# Altium project PCB_Project_3.PrjPcb
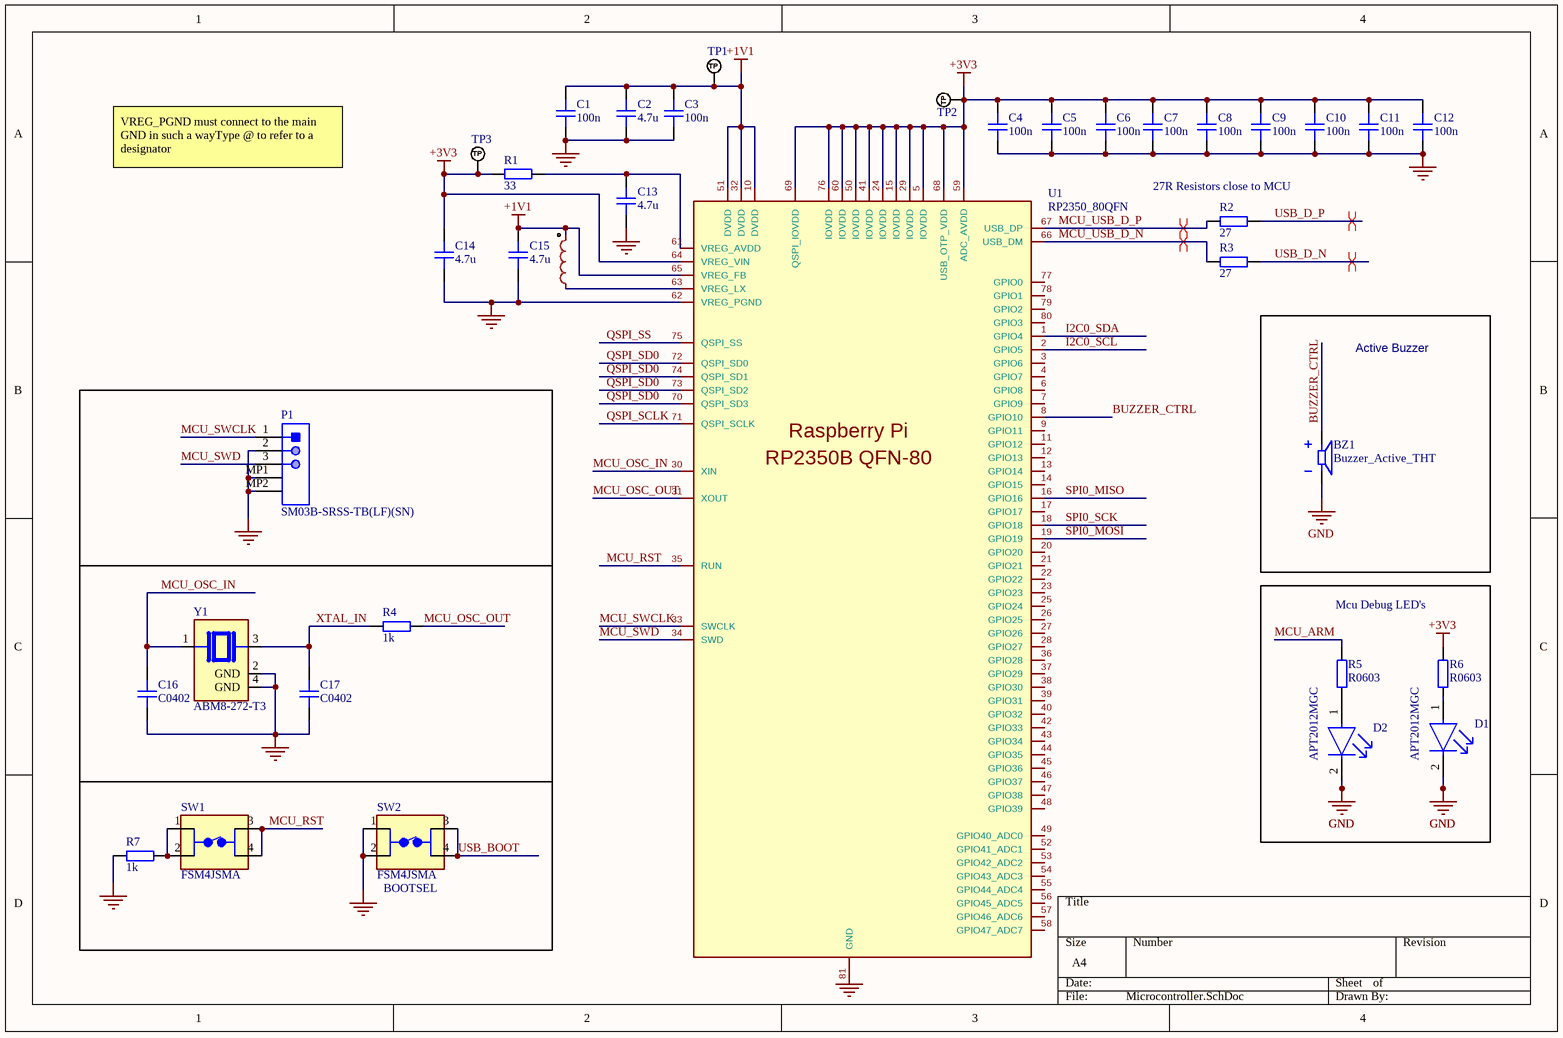
[diagram p0: Microcontroller.SchDoc]
5 sheets, 101 parts. Net scope: global (net labels, ports and power ports of the same name join across sheets).
Board file: PCB1.PcbDoc
Sheets:
  Microcontroller.SchDoc
  Firing channels.SchDoc
  MCU_SLAVES.SchDoc
  Sheet2.SchDoc
  storage.SchDoc

## Sheet Microcontroller.SchDoc
size A4; SheetNumber: 1; SheetTotal: 6

### Parts
BZ1  Buzzer_Active_THT  [Buzzer_Active_Tht]
C1  100n  [CAP_0402]
C2  4.7u  [CAP_0402]
C3  100n  [CAP_0402]
C4  100n  [CAP_0402]
C5  100n  [CAP_0402]
C6  100n  [CAP_0402]
C7  100n  [CAP_0402]
C8  100n  [CAP_0402]
C9  100n  [CAP_0402]
C10  100n  [CAP_0402]
C11  100n  [CAP_0402]
C12  100n  [CAP_0402]
C13  4.7u  [CAP_0402]
C14  4.7u  [CAP_0402]
C15  4.7u  [CAP_0402]
C16  C0402  [CAP_0402]
C17  C0402  [CAP_0402]
D1  APT2012MGC  [FP-APT2012MGC-MFG]
D2  APT2012MGC  [FP-APT2012MGC-MFG]
L1  3.3uH  [IND-SMD_L2.0-W1.6_AOTA-B201610S3R3-101-T]  (value not drawn)
P1  SM03B-SRSS-TB(LF)(SN)  [JST-SM03B-SRSS-TB_V]
R1  33  [RES_0402]
R2  27  [RES_0402]
R3  27  [RES_0402]
R4  1k  [RES_0402]
R5  R0603  [RES_0603]
R6  R0603  [RES_0603]
R7  1k  [RES_0402]
SW1  FSM4JSMA  [TE_FSM4JSMA]
SW2  FSM4JSMA  [TE_FSM4JSMA]
TP1  TEST_POINT_RND_1MM  [PAD_RND_1MM]  (value not drawn)  (no BOM)
TP2  TEST_POINT_RND_1MM  [PAD_RND_1MM]  (value not drawn)  (no BOM)
TP3  TEST_POINT_RND_1MM  [PAD_RND_1MM]  (value not drawn)  (no BOM)
U1  RP2350_80QFN  [RP2350-QFN-80-1EP_10x10_P0.4mm_EP3.4x3.4mm_ThermalVias]
Y1  ABM8-272-T3  [XTAL_ABM8-272-T3]

### Blocks framed on the sheet
Active Buzzer: BZ1
BOOTSEL: C16 C17 P1 R4 R7 SW1 SW2 Y1
Mcu Debug LED's: D1 D2 R5 R6

### Nets
+1V1: C1.1 C2.1 C3.1 C15.1 L1.2 TP1.1(TP) U1.10(DVDD) U1.32(DVDD) U1.51(DVDD) U1.65(VREG_FB)
+3V3: C4.1 C5.1 C6.1 C7.1 C8.1 C9.1 C10.1 C11.1 C12.1 C14.1 R1.2 R6.2 TP2.1(TP) TP3.1(TP) U1.5(IOVDD) U1.15(IOVDD) U1.24(IOVDD) U1.29(IOVDD) U1.41(IOVDD) U1.50(IOVDD) U1.59(ADC_AVDD) U1.60(IOVDD) U1.64(VREG_VIN) U1.68(USB_OTP_VDD) U1.69(QSPI_IOVDD) U1.76(IOVDD)
GND: BZ1.N C1.2 C2.2 C3.2 C4.2 C5.2 C6.2 C7.2 C8.2 C9.2 C10.2 C11.2 C12.2 C13.2 C14.2 C15.2 C16.2 C17.2 D1.2(C) D2.2(C) P1.2 P1.MP1 P1.MP2 R7.2 SW2.1 SW2.2 U1.62(VREG_PGND) U1.81(GND) Y1.2(GND) Y1.4(GND)
BUZZER_CTRL: BZ1.P U1.8(GPIO10)
I2C0_SCL: U1.2(GPIO5)
I2C0_SDA: U1.1(GPIO4)
MCU_ARM: R5.2
MCU_OSC_IN: C16.1 U1.30(XIN) Y1.1
MCU_OSC_OUT: R4.1 U1.31(XOUT)
MCU_RST: SW1.3 SW1.4 U1.35(RUN)
MCU_SWCLK: P1.1 U1.33(SWCLK)
MCU_SWD: P1.3 U1.34(SWD)
MCU_USB_D_N: R3.2 U1.66(USB_DM)
MCU_USB_D_P: R2.2 U1.67(USB_DP)
QSPI_SCLK: U1.71(QSPI_SCLK)
QSPI_SD0: U1.70(QSPI_SD3) U1.72(QSPI_SD0) U1.73(QSPI_SD2) U1.74(QSPI_SD1)
QSPI_SS: U1.75(QSPI_SS)
SPI0_MISO: U1.16(GPIO16)
SPI0_MOSI: U1.19(GPIO19)
SPI0_SCK: U1.18(GPIO18)
USB_BOOT: SW2.3 SW2.4
USB_D_N: R3.1
USB_D_P: R2.1
XTAL_IN: C17.1 R4.2 Y1.3
NetC13_1: C13.1 R1.1 U1.61(VREG_AVDD)
NetD1_1: D1.1(A) R6.1
NetD2_1: D2.1(A) R5.1
NetL1_1: L1.1 U1.63(VREG_LX)
NetR7_1: R7.1 SW1.1 SW1.2

Not connected (* = marked no-connect by the designer): U1 3(GPIO6) 4(GPIO7) 6(GPIO8) 7(GPIO9) 9(GPIO11) 11(GPIO12) 12(GPIO13) 13(GPIO14) 14(GPIO15) 17(GPIO17) 20(GPIO20) 21(GPIO21) 22(GPIO22) 23(GPIO23) 25(GPIO24) 26(GPIO25) 27(GPIO26) 28(GPIO27) 36(GPIO28) 37(GPIO29) 38(GPIO30) 39(GPIO31) 40(GPIO32) 42(GPIO33) 43(GPIO34) 44(GPIO35) 45(GPIO36) 46(GPIO37) 47(GPIO38) 48(GPIO39) 49(GPIO40_ADC0) 52(GPIO41_ADC1) 53(GPIO42_ADC2) 54(GPIO43_ADC3) 55(GPIO44_ADC4) 56(GPIO45_ADC5) 57(GPIO46_ADC6) 58(GPIO47_ADC7) 77(GPIO0) 78(GPIO1) 79(GPIO2) 80(GPIO3)

### Layout directives
differential pair: MCU_USB_D_N, MCU_USB_D_P, USB_D_N, USB_D_P

### Notes on the sheet
- VREG_PGND must connect to the main GND in such a wayType @ to refer to a designator
- 27R Resistors close to MCU
- (in symbol RP2350_80QFN) Raspberry Pi; RP2350B QFN-80

### Library data of the parts
C1-C17 = CAP_0402: Capacitor SMD 0402; Manufacturer: *; Manufacturer Part Number: *; Distributor Link: *; LCSC: *; Rating: *; Dielectric: *
D1 D2 = CMP-44529-000017-1: LED GREEN CLEAR CHIP SMD; Power Rating: 75mW; Lens Color: Colorless; Luminous Intensity: 70mcd; Forward Current: 20mA; Dominant Wavelength: 570nm; Viewing Angle: 120°; Forward Voltage: 2.1V; Package Quantity: 2000; Color: Green; Length: 2mm; Lead Free: Lead Free; Min Operating Temperature: -40°C; Illumination Color: Green; Case/Package: 0805; Width: 1.25mm; Test Current: 20mA; Max Operating Temperature: 85°C; Case Code (Imperial): 0805; Mount: Surface Mount; Lens Style: Clear; Height: 0.75mm; Case Code (Metric): 2012; Packaging: Tape and Reel; Lens Transparency: Clear
L1 = AOTA-B201610S3R3-101-T: Manufacturer: ABRACON; Add into BOM: yes; Current Rating: 2.1A; Current - Saturation(Isat): 2.4A; DC Resistance(DCR): 115mΩ; Type: Molded Inductor; Symbol: AOTA-B201610S3R3-101-T; Device: AOTA-B201610S3R3-101-T; LCSC Part Name: 3.3uH 2.4A; Supplier Part: C42411119; Manufacturer Part: AOTA-B201610S3R3-101-T; Supplier Footprint: 0806; JLCPCB Part Class: Extended Part; Datasheet: https://item.szlcsc.com/datasheet/AOTA-B201610S3R3-101-T/44392932.html; Supplier: LCSC; Convert to PCB: yes; Value: 3.3uH
P1 = CMP-2000-07077-1: Male Header, Pitch 1 mm, 1 x 3 Position, Height 2.9 mm, -25 to 85 degC, RoHS, Tape and Reel; Manufacturer: JST; Pitch: 1mm; Style/Orientation: RightAngleHeader/Plug; No of Positions: 3; Package Description: Male Header, Pitch 1 mm, 1 x 3 Position, Height 2.9 mm; Manufacturer URL: http://www.jst.com/home2.html; Package Reference: SM03B-SRSS-TB; Type: ShroudedHeader; Termination: Crimp; Mounting Technology: SurfaceMount; Datasheet Version: 11/2010; Datasheet URL: https://datasheet.ciiva.com/26894/getdatasheetpartid-708885-26894671.pdf
R1-R4 R7 = RES_0402: Resistor SMD 0402; Manufacturer: *; Manufacturer Part Number: *; Distributor Link: *; LCSC: *
R5 R6 = RES_0603: Resistor SMD 0603; Manufacturer: *; Manufacturer Part Number: *; Distributor Link: *; LCSC: *
SW1 SW2 = FSM4JSMA: Tactile Switch SPST-NO Top Actuated Surface Mount; MF: TE Connectivity; MP: FSM-4J-SMA; SnapEDA_Link: https://www.snapeda.com/parts/FSM-4J-SMA/TE+Connectivity+ALCOSWITCH+Switches/view-part/?ref=snap; Package: None; Value: *; Check_prices: https://www.snapeda.com/parts/FSM-4J-SMA/TE+Connectivity+ALCOSWITCH+Switches/view-part/?ref=eda
TP1-TP3 = CMP-019-000001-1: Test Point Round 1mm (NO BOM); Design Item ID: TEST_POINT_RND_1MM; Source: Schematic-Lib-PhilsLab.SchLib
Y1 = ABM8-272-T3: 12 MHz Â±30ppm Crystal 10pF 50 Ohms 4-SMD, No Lead; MF: ABRACON; SnapEDA_Link: https://www.snapeda.com/parts/ABM8-272-T3/Abracon/view-part/?ref=snap; Package: NON-STANDARD-4 Abracon; Value: *; MP: ABM8-272-T3; Check_prices: https://www.snapeda.com/parts/ABM8-272-T3/Abracon/view-part/?ref=eda

## Sheet Firing channels.SchDoc
size 381 x 241 mm; SheetNumber: 2; SheetTotal: 6
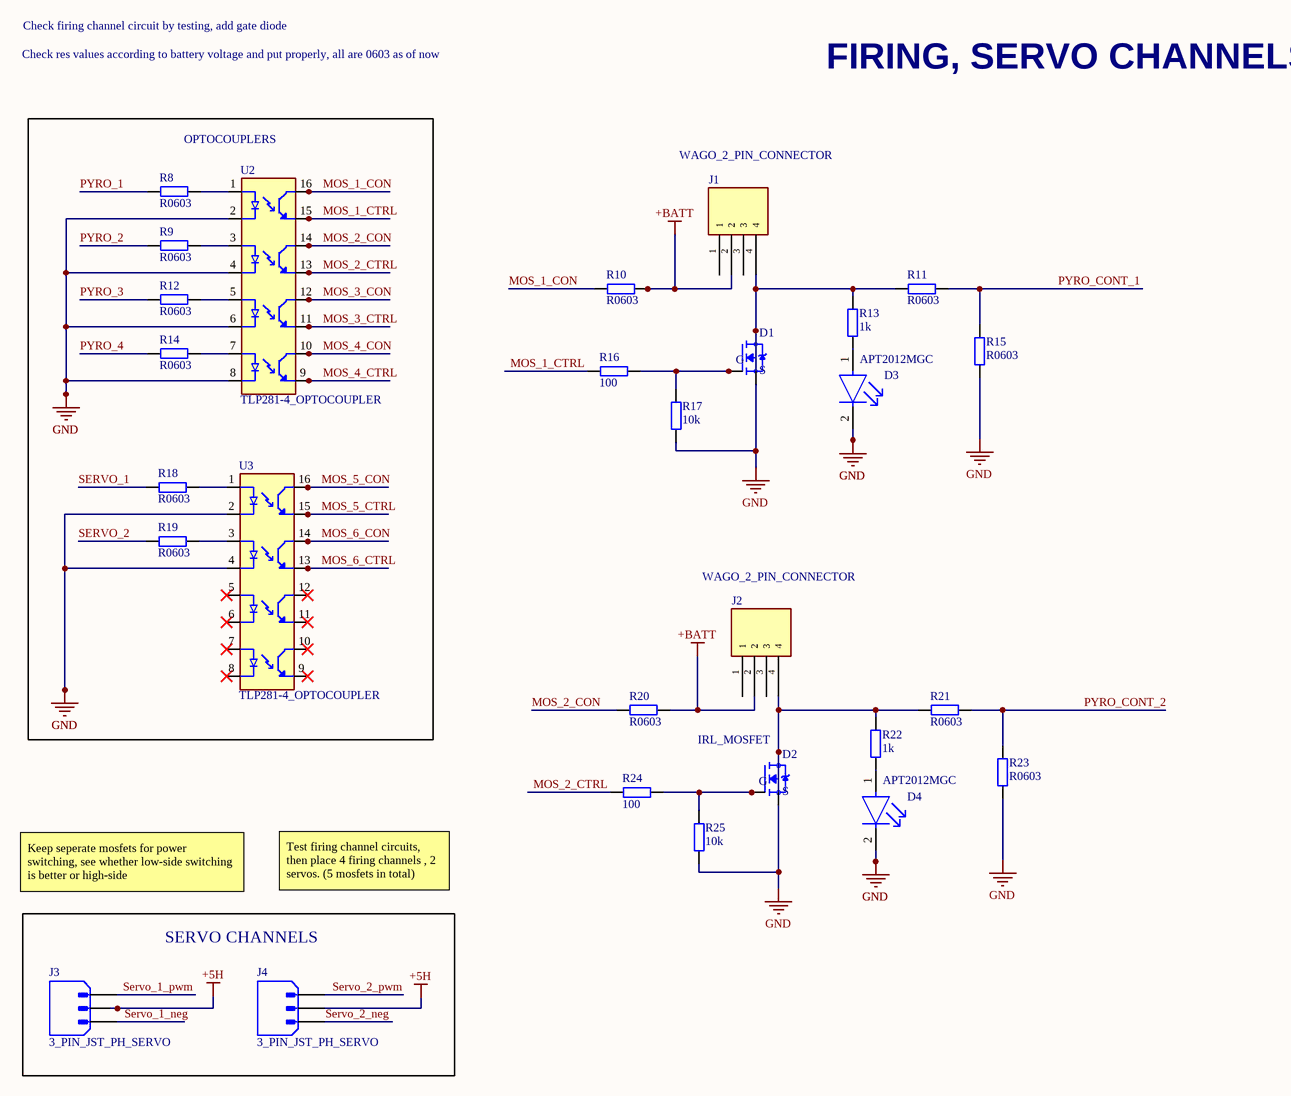
[diagram p1: Firing channels.SchDoc]

### Parts
1  (no value)  [IRLR7843]
2  IRL_MOSFET  [IRLR7843]
D3  APT2012MGC  [FP-APT2012MGC-MFG]
D4  APT2012MGC  [FP-APT2012MGC-MFG]
J1  WAGO_2_PIN_CONNECTOR  [WAGO_CONNECTOR]
J2  WAGO_2_PIN_CONNECTOR  [WAGO_CONNECTOR]
J3  3_PIN_JST_PH_SERVO  [3_PIN_JST_PH_SERVO]
J4  3_PIN_JST_PH_SERVO  [3_PIN_JST_PH_SERVO]
R8  R0603  [RES_0603]
R9  R0603  [RES_0603]
R10  R0603  [RES_0603]
R11  R0603  [RES_0603]
R12  R0603  [RES_0603]
R13  1k  [RES_0603]
R14  R0603  [RES_0603]
R15  R0603  [RES_0603]
R16  100  [RES_0603]
R17  10k  [RES_0603]
R18  R0603  [RES_0603]
R19  R0603  [RES_0603]
R20  R0603  [RES_0603]
R21  R0603  [RES_0603]
R22  1k  [RES_0603]
R23  R0603  [RES_0603]
R24  100  [RES_0603]
R25  10k  [RES_0603]
U2  TLP281-4_OPTOCOUPLER  [TLP281-4_OPTOCOUPLER]
U3  TLP281-4_OPTOCOUPLER  [TLP281-4_OPTOCOUPLER]

### Blocks framed on the sheet
OPTOCOUPLERS: R8 R9 R12 R14 R18 R19 U2 U3
SERVO CHANNELS: J3 J4

### Nets
+5H: J3.2 J4.2
+BATT: J1.2 J2.2 R10.2 R20.2
GND: 1.2(S) 2.2(S) D3.2(C) D4.2(C) R15.1 R17.1 R23.1 R25.1 U2.2(C1) U2.4(C2) U2.6(C3) U2.8(C4) U3.2(C1) U3.4(C2)
MOS_1_CON: R10.1 U2.16(CT1)
MOS_1_CTRL: R16.1 U2.15(ET1)
MOS_2_CON: R20.1 U2.14(CT2)
MOS_2_CTRL: R24.1 U2.13(ET2)
MOS_3_CON: U2.12(CT3)
MOS_3_CTRL: U2.11(ET3)
MOS_4_CON: U2.10(CT4)
MOS_4_CTRL: U2.9(ET4)
MOS_5_CON: U3.16(CT1)
MOS_5_CTRL: U3.15(ET1)
MOS_6_CON: U3.14(CT2)
MOS_6_CTRL: U3.13(ET2)
PYRO_1: R8.1
PYRO_2: R9.1
PYRO_3: R12.1
PYRO_4: R14.1
PYRO_CONT_1: R11.2 R15.2
PYRO_CONT_2: R21.2 R23.2
SERVO_1: R18.1
Servo_1_neg: J3.1
Servo_1_pwm: J3.3
SERVO_2: R19.1
Servo_2_neg: J4.1
Servo_2_pwm: J4.3
Net1_1: 1.1(G) R16.2 R17.2
Net1_3: 1.3(D) J1.4 R11.1 R13.2
Net2_1: 2.1(G) R24.2 R25.2
Net2_3: 2.3(D) J2.4 R21.1 R22.2
NetD3_1: D3.1(A) R13.1
NetD4_1: D4.1(A) R22.1
NetR8_2: R8.2 U2.1(A1)
NetR9_2: R9.2 U2.3(A2)
NetR12_2: R12.2 U2.5(A3)
NetR14_2: R14.2 U2.7(A4)
NetR18_2: R18.2 U3.1(A1)
NetR19_2: R19.2 U3.3(A2)

Not connected (* = marked no-connect by the designer): J1 1 3; J2 1 3; U3 5(A3)* 6(C3)* 7(A4)* 8(C4)* 9(ET4)* 10(CT4)* 11(ET3)* 12(CT3)*

### Notes on the sheet
- Check firing channel circuit by testing, add gate diode
- Check res values according to battery voltage and put properly, all are 0603 as of now
- FIRING, SERVO CHANNELS
- Keep seperate mosfets for power switching, see whether low-side switching is better or high-side
- Test firing channel circuits, then place 4 firing channels , 2 servos. (5 mosfets in total)

### Library data of the parts
1 = IRL_MOSFET
D3 D4 = CMP-44529-000017-1: as D1 on sheet Microcontroller; Package Quantity: 2000; Color: Green; Length: 2mm; Lead Free: Lead Free; Min Operating Temperature: -40°C; Illumination Color: Green; Case/Package: 0805; Width: 1.25mm; Test Current: 20mA; Max Operating Temperature: 85°C; Case Code (Imperial): 0805; Mount: Surface Mount; Lens Style: Clear; Height: 0.75mm; Case Code (Metric): 2012; Packaging: Tape and Reel; Lens Transparency: Clear
R8-R25 = RES_0603: Resistor SMD 0603; Manufacturer: *; Manufacturer Part Number: *; Distributor Link: *; LCSC: *

## Sheet MCU_SLAVES.SchDoc
size A4; SheetNumber: 3; SheetTotal: 6
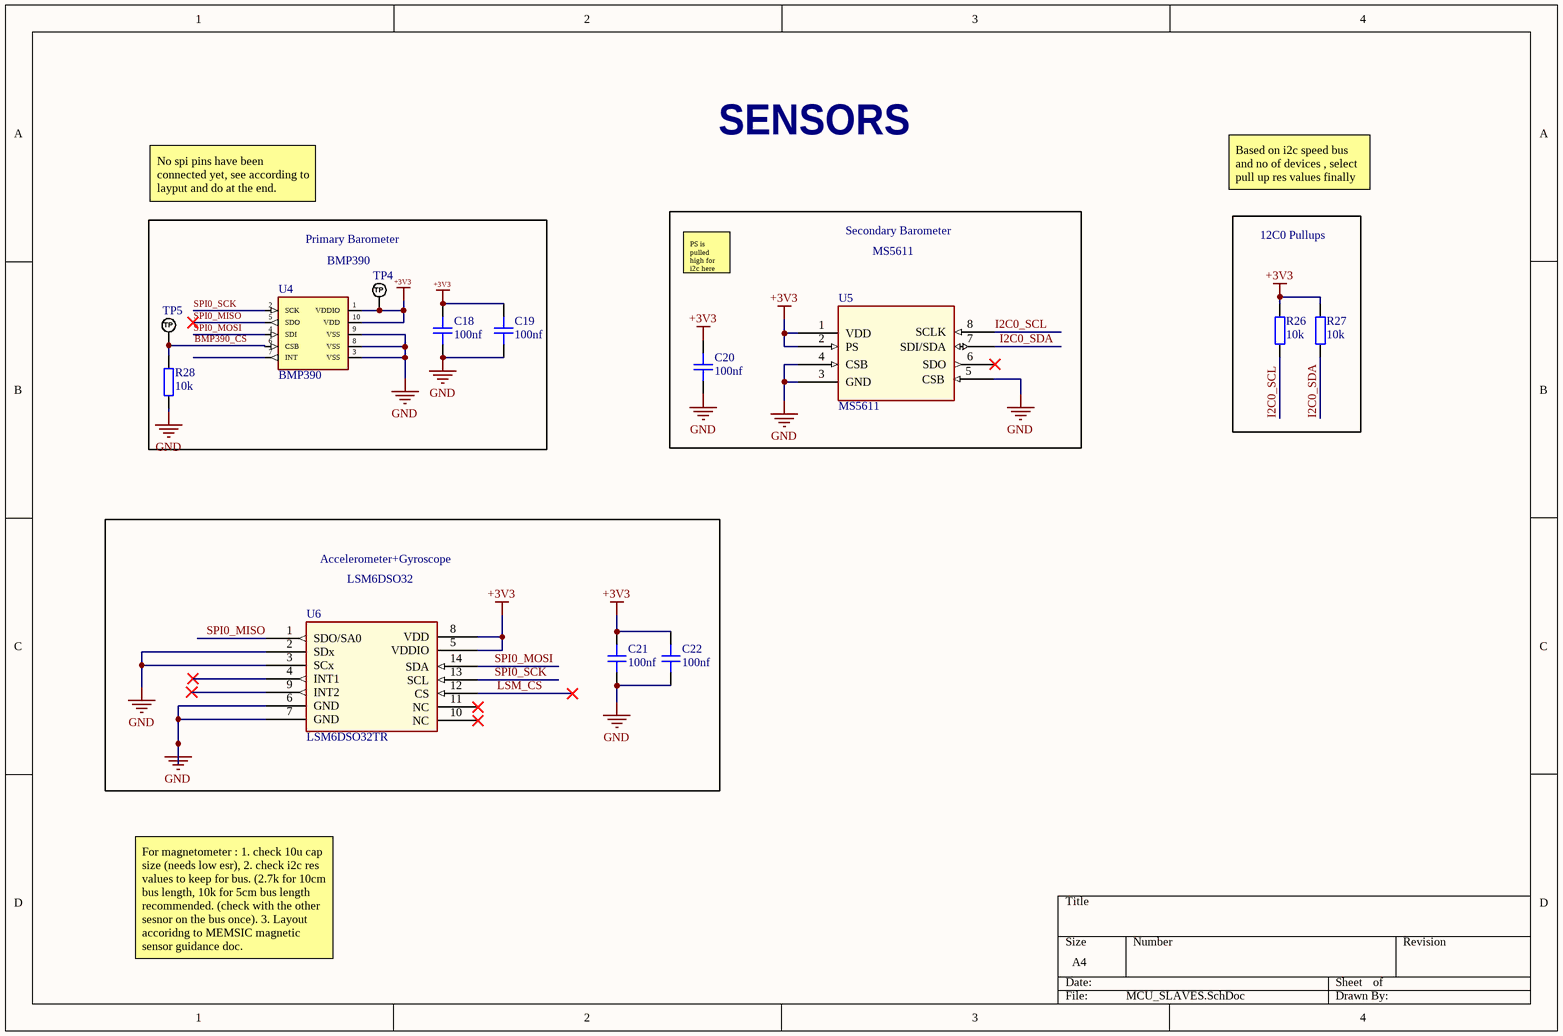
[diagram p2: MCU_SLAVES.SchDoc]

### Parts
C18  100nf  [CAP_0402]
C19  100nf  [CAP_0402]
C20  100nf  [CAP_0402]
C21  100nf  [CAP_0402]
C22  100nf  [CAP_0402]
R26  10k  [RES_0402]
R27  10k  [RES_0402]
R28  10k  [RES_0402]
TP4  TEST_POINT_RND_1MM  [PAD_RND_1MM]  (value not drawn)  (no BOM)
TP5  TEST_POINT_RND_1MM  [PAD_RND_1MM]  (value not drawn)  (no BOM)
U4  BMP390  [BMP390]
U5  MS5611  [MS5611]
U6  LSM6DSO32TR  [LSM6DSO32TR]

### Blocks framed on the sheet
12C0 Pullups: R26 R27

### Nets
+3V3: C18.2 C19.2 C20.2 C21.2 C22.1 R26.2 R27.2 TP4.1(TP) U4.1(VDDIO) U4.10(VDD) U5.1(VDD) U5.2(PS) U6.5(VDDIO) U6.8(VDD)
GND: C18.1 C19.1 C20.1 C21.1 C22.2 R28.1 U4.3(VSS) U4.8(VSS) U4.9(VSS) U5.3(GND) U5.4(CSB) U5.5(CSB) U6.2(SDx) U6.3(SCx) U6.6(GND) U6.7(GND)
BMP390_CS: R28.2 TP5.1(TP) U4.6(CSB)
I2C0_SCL: R26.1 U5.8(SCLK)
I2C0_SDA: R27.1 U5.7(SDI/SDA)
LSM_CS: U6.12(CS)
SPI0_MISO: U4.5(SDO) U6.1(SDO/SA0)
SPI0_MOSI: U4.4(SDI) U6.14(SDA)
SPI0_SCK: U4.2(SCK) U6.13(SCL)

Not connected (* = marked no-connect by the designer): U4 7(INT); U5 6(SDO)*; U6 4(INT1)* 9(INT2)* 10(NC)* 11(NC)*

### Notes on the sheet
- SENSORS
- No spi pins have been connected yet, see according to layput and do at the end.
- Primary Barometer
- Secondary Barometer
- Based on i2c speed bus and no of devices , select pull up res values finally
- BMP390
- PS is pulled high for i2c here
- MS5611
- Accelerometer+Gyroscope
- (near U6) LSM6DSO32
- For magnetometer : 1. check 10u cap size (needs low esr), 2. check i2c res values to keep for bus. (2.7k for 10cm bus length, 10k for 5cm bus length recommended. (check with the other sesnor on the bus once). 3. Layout accoridng to MEMSIC magnetic sensor guidance doc.

### Library data of the parts
C18-C22 = CAP_0402: Capacitor SMD 0402; Manufacturer: *; Manufacturer Part Number: *; Distributor Link: *; LCSC: *; Rating: *; Dielectric: *
R26-R28 = RES_0402: Resistor SMD 0402; Manufacturer: *; Manufacturer Part Number: *; Distributor Link: *; LCSC: *
TP4 TP5 = CMP-019-000001-1: Test Point Round 1mm (NO BOM); Design Item ID: TEST_POINT_RND_1MM; Source: Schematic-Lib-PhilsLab.SchLib

## Sheet Sheet2.SchDoc
size A4; SheetNumber: 4; SheetTotal: 5
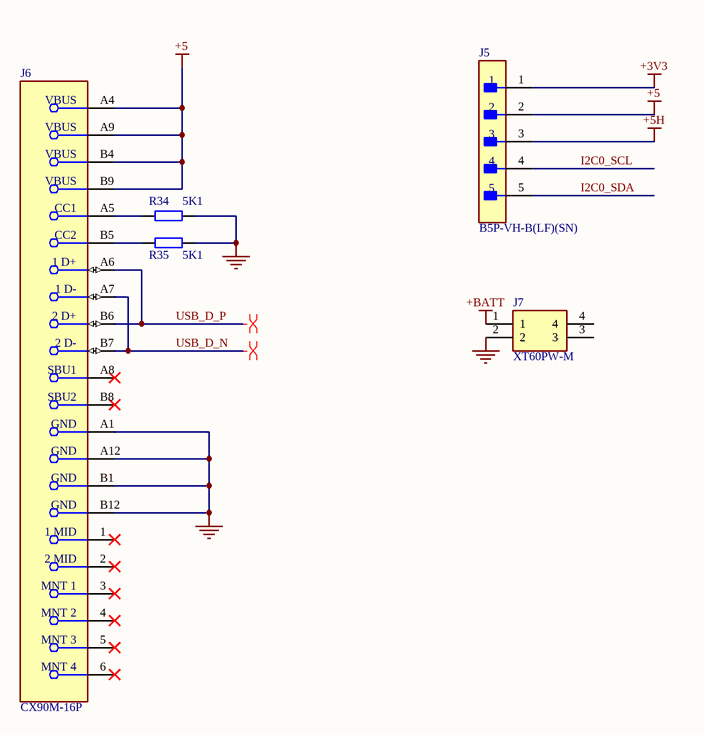
[diagram p3: Sheet2.SchDoc]

### Parts
J5  B5P-VH-B(LF)(SN)  [FP-B5P-VH-B_LF_SN-MFG]
J6  CX90M-16P  [FP-CX90M-16P-MFG]
J7  XT60PW-M  [XT60PWM]
R34  5K1  [RES_0402]
R35  5K1  [RES_0402]

### Nets
+3V3: J5.1
+5: J5.2 J6.A4(VBUS) J6.A9(VBUS) J6.B4(VBUS) J6.B9(VBUS)
+5H: J5.3
+BATT: J7.1
GND: J6.A1(GND) J6.A12(GND) J6.B1(GND) J6.B12(GND) J7.2 R34.2 R35.2
I2C0_SCL: J5.4
I2C0_SDA: J5.5
USB_D_N: J6.A7(1_D-) J6.B7(2_D-)
USB_D_P: J6.A6(1_D+) J6.B6(2_D+)
NetJ6_A5: J6.A5(CC1) R34.1
NetJ6_B5: J6.B5(CC2) R35.1

Not connected (* = marked no-connect by the designer): J6 1(1_MID)* 2(2_MID)* 3(MNT_1)* 4(MNT_2)* 5(MNT_3)* 6(MNT_4)* A8(SBU1)* B8(SBU2)*; J7 3 4

### Layout directives
differential pair: USB_D_N, USB_D_P

### Library data of the parts
J5 = CMP-17439-000483-1: CONN HEADER VERT 5POS 3.96MM; Contact Resistance: 20mR; Number of Positions: 5; Max Current Rating: 10A; Voltage Rating: 250V; Min Operating Temperature: -25°C; Fastening Type: Ramp; Max Operating Temperature: 85°C; Series: VH; Contact Finish - Mating: TIN; Depth: 8.5mm; Insulation Color: Natural; Length: 19.74mm; Number of Rows: 1; Flammability Rating: UL94 V-0; Orientation: Straight; Packaging: Bulk; Lead Free: Lead Free; Pitch: 3.96mm; Contact Material: Brass; Connector Type: Header; Housing Color: White; Contact Plating: Copper; Number of Pins: 5; Contact Shape: Square; Insulation Material: PBT; Max Voltage Rating (AC): 250V; Contact Type: Male Pin; Color: White; Termination: Solder
J6 = CMP-11601-000005-1: CONN RCPT USB2.0 TYPEC 16POS SMD; Connector Type: USB; Current Rating: 1.25A; Mating Cycles: 10000; Number of Contacts: 16; Gender: Receptacle; Shielding: Shielded; Number of Ports: 1; Insulation Color: Black; Termination: Solder; Min Operating Temperature: -30°C; Flammability Rating: UL94 V-0; Max Operating Temperature: 85°C; Packaging: Cut Tape; Contact Plating: Gold; Mount: Surface Mount
J7 = XT60PW-M: Connector; Manufacturer_Name: Changzou Amass Elec; Datasheet Link: https://www.tme.eu/Document/9b8d0c5eb7094295f3d3112c214d3ade/XT60PW%20SPEC.pdf; Height: 8.4mm; Manufacturer_Part_Number: XT60PW-M
R34 R35 = RES_0402: Resistor SMD 0402; Manufacturer: *; Manufacturer Part Number: *; Distributor Link: *; LCSC: *

## Sheet storage.SchDoc
size A4; SheetNumber: 5; SheetTotal: 5
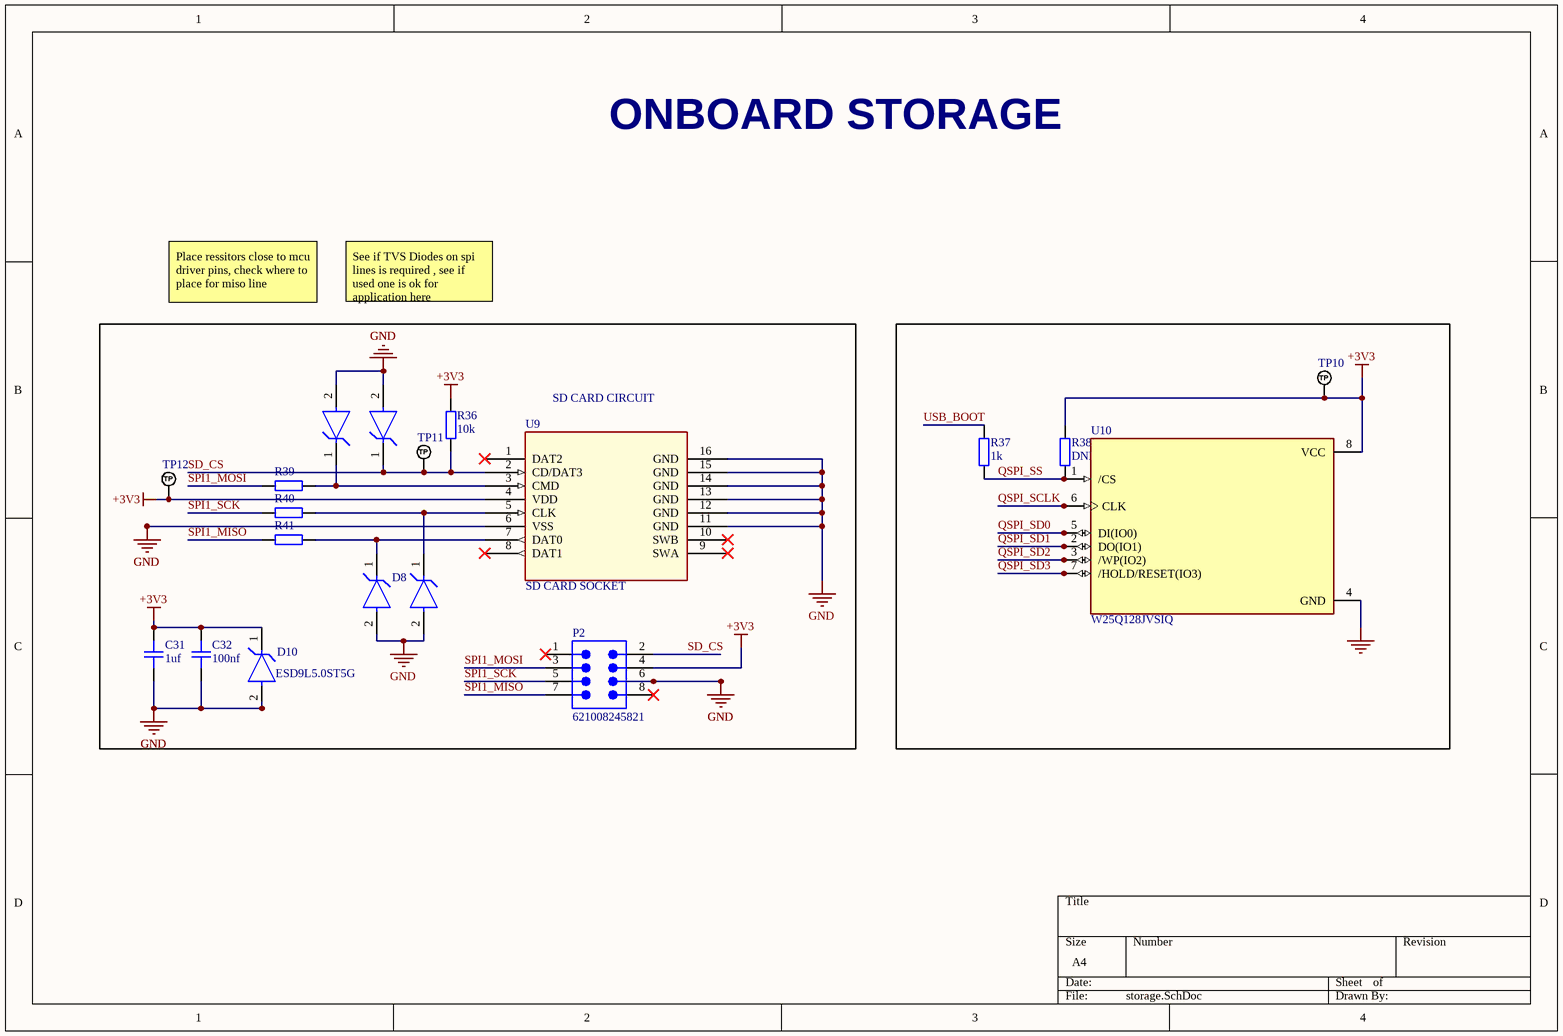
[diagram p4: storage.SchDoc]

### Parts
C31  1uf  [CAP_0805]
C32  100nf  [CAP_0402]
D6  ESD9L5.0ST5G  [On_Semiconductor_514AB_MFG]  (value not drawn)
D7  ESD9L5.0ST5G  [On_Semiconductor_514AB_MFG]  (value not drawn)
D8  ESD9L5.0ST5G  [On_Semiconductor_514AB_MFG]  (value not drawn)
D9  ESD9L5.0ST5G  [On_Semiconductor_514AB_MFG]  (value not drawn)
D10  ESD9L5.0ST5G  [On_Semiconductor_514AB_MFG]
P2  621008245821  [621008245821]
R36  10k  [RES_0603]
R37  1k  [RES_0402]
R38  DNF  [RES_0402]
R39  22 ohm  [RES_0603]  (value not drawn)
R40  22 ohm  [RES_0603]  (value not drawn)
R41  22 ohm  [RES_0603]  (value not drawn)
TP10  TEST_POINT_RND_1MM  [PAD_RND_1MM]  (value not drawn)  (no BOM)
TP11  TEST_POINT_RND_1MM  [PAD_RND_1MM]  (value not drawn)  (no BOM)
TP12  TEST_POINT_RND_1MM  [PAD_RND_1MM]  (value not drawn)  (no BOM)
U9  SD CARD SOCKET  [SD CARD SOCKET]
U10  W25Q128JVSIQ  [SOIC127P790X216-8N]

### Blocks framed on the sheet
SD CARD CIRCUIT: C31 C32 D6-D10 P2 R36 R39-R41 TP11 TP12 U9

### Nets
+3V3: C31.2 C32.2 D10.1(C) P2.4 R36.2 R38.2 TP10.1(TP) TP12.1(TP) U9.4(VDD) U10.8(VCC)
GND: C31.1 C32.1 D6.2(A) D7.2(A) D8.2(A) D9.2(A) D10.2(A) P2.6 U9.6(VSS) U9.11(GND) U9.12(GND) U9.13(GND) U9.14(GND) U9.15(GND) U9.16(GND) U10.4(GND)
QSPI_SCLK: U10.6(CLK)
QSPI_SD0: U10.5(DI(IO0))
QSPI_SD1: U10.2(DO(IO1))
QSPI_SD2: U10.3(/WP(IO2))
QSPI_SD3: U10.7(/HOLD/RESET(IO3))
QSPI_SS: R37.1 R38.1 U10.1(/CS)
SD_CS: D7.1(C) P2.2 R36.1 TP11.1(TP) U9.2(CD/DAT3)
SPI1_MISO: P2.7 R41.1
SPI1_MOSI: P2.3 R39.1
SPI1_SCK: P2.5 R40.1
USB_BOOT: R37.2
NetD6_1: D6.1(C) R39.2 U9.3(CMD)
NetD8_1: D8.1(C) R41.2 U9.7(DAT0)
NetD9_1: D9.1(C) R40.2 U9.5(CLK)

Not connected (* = marked no-connect by the designer): P2 1* 8*; U9 1(DAT2)* 8(DAT1)* 9(SWA)* 10(SWB)*

### Notes on the sheet
- ONBOARD STORAGE
- Place ressitors close to mcu driver pins, check where to place for miso line
- See if TVS Diodes on spi lines is required , see if used one is ok for application here

### Library data of the parts
C31 = CAP_0805: Capacitor SMD 0805; Manufacturer: *; Manufacturer Part Number: *; Distributor Link: *; LCSC: *; Rating: *; Dielectric: *
C32 = CAP_0402: Capacitor SMD 0402; Manufacturer: *; Manufacturer Part Number: *; Distributor Link: *; LCSC: *; Rating: *; Dielectric: *
D6-D10 = CMP-1063-00114-2: NexarPartId: 6987432; Manufacturer Lifecycle Status: ACTIVE; Polarity: Unidirectional; Max Surge Current: 1A; Reverse Standoff Voltage: 5V; ESD Protection: Yes; Capacitance: 500fF; Power Line Protection: No; Test Current: 1mA; Max Reverse Leakage Current: 1µA; Peak Pulse Power: 150mW; Clamping Voltage: 9.8V; Number of Unidirectional Channels: 1; Element Configuration: Single; Min Breakdown Voltage: 5.4V; Max Junction Temperature (Tj): 150°C; Reverse Breakdown Voltage: 5.8V; Length: 800µm; Min Operating Temperature: -55°C; Packaging: Tape and Reel; Width: 650µm; Height: 400µm; RoHS: Compliant; Number of Pins: 2; Lifecycle Status: Production; Schedule B: 8536300000; Operating Supply Voltage: 5V; Termination: SMD/SMT; Power Dissipation: 150mW; Direction: Unidirectional; Depth: 600µm; Composition: Zener; Lead Free: Lead Free; Contact Plating: Tin; Number of Lines: 1; Peak Pulse Current: 1A; REACH SVHC: No SVHC; Number of Channels: 1; Radiation Hardening: No; Number of Elements: 1; Max Operating Temperature: 150°C; Max Breakdown Voltage: 5.4V; Case/Package: SOD-923-2; Breakdown Voltage: 5.4V; Halogen Free: Halogen Free; Leakage Current: 1µA; Working Voltage: 5V
P2 = CMP-1502-00997-4: SMT Vertical Pin Header WR-PHD, Pitch 2.00 mm, Dual Row, 8 pins; Contact Resistance: 20mΩ; Current Rating: 2A; Operating Supply Voltage: 200V; Gender: Male; Number of Pins: 8; Orientation: Vertical; Lead Pitch: 2mm; RoHS: Non-Compliant
R36 R39-R41 = RES_0603: Resistor SMD 0603; Manufacturer: *; Manufacturer Part Number: *; Distributor Link: *; LCSC: *
R37 R38 = RES_0402: Resistor SMD 0402; Manufacturer: *; Manufacturer Part Number: *; Distributor Link: *; LCSC: *
TP10-TP12 = CMP-019-000001-1: Test Point Round 1mm (NO BOM); Design Item ID: TEST_POINT_RND_1MM; Source: Schematic-Lib-PhilsLab.SchLib
U10 = W25Q128JVSIQ: FLASH - NOR Memory IC 128Mb (16M x 8) SPI - Quad I/O, QPI, DTR 133 MHz 8-SOIC; MF: Winbond Electronics; SnapEDA_Link: https://www.snapeda.com/parts/W25Q128JVSIQ/Winbond/view-part/?ref=snap; Package: SOIC-8 Winbond Electronics; Value: *; MP: W25Q128JVSIQ; Check_prices: https://www.snapeda.com/parts/W25Q128JVSIQ/Winbond/view-part/?ref=eda

## Nets that join several sheets
+3V3: Microcontroller (26 pins), MCU_SLAVES (14 pins), Sheet2 (J5.1), storage (10 pins)
+5H: Firing channels (J3.2 J4.2), Sheet2 (J5.3)
+BATT: Firing channels (J1.2 J2.2 R10.2 R20.2), Sheet2 (J7.1)
GND: Microcontroller (30 pins), Firing channels (14 pins), MCU_SLAVES (16 pins), Sheet2 (7 pins), storage (16 pins)
I2C0_SCL: Microcontroller (U1.2), MCU_SLAVES (R26.1 U5.8), Sheet2 (J5.4)
I2C0_SDA: Microcontroller (U1.1), MCU_SLAVES (R27.1 U5.7), Sheet2 (J5.5)
QSPI_SCLK: Microcontroller (U1.71), storage (U10.6)
QSPI_SD0: Microcontroller (U1.70 U1.72 U1.73 U1.74), storage (U10.5)
QSPI_SS: Microcontroller (U1.75), storage (R37.1 R38.1 U10.1)
SPI0_MISO: Microcontroller (U1.16), MCU_SLAVES (U4.5 U6.1)
SPI0_MOSI: Microcontroller (U1.19), MCU_SLAVES (U4.4 U6.14)
SPI0_SCK: Microcontroller (U1.18), MCU_SLAVES (U4.2 U6.13)
USB_BOOT: Microcontroller (SW2.3 SW2.4), storage (R37.2)
USB_D_N: Microcontroller (R3.1), Sheet2 (J6.A7 J6.B7)
USB_D_P: Microcontroller (R2.1), Sheet2 (J6.A6 J6.B6)